# EAGLE design MicroViewUSB (EAGLE 5.11)
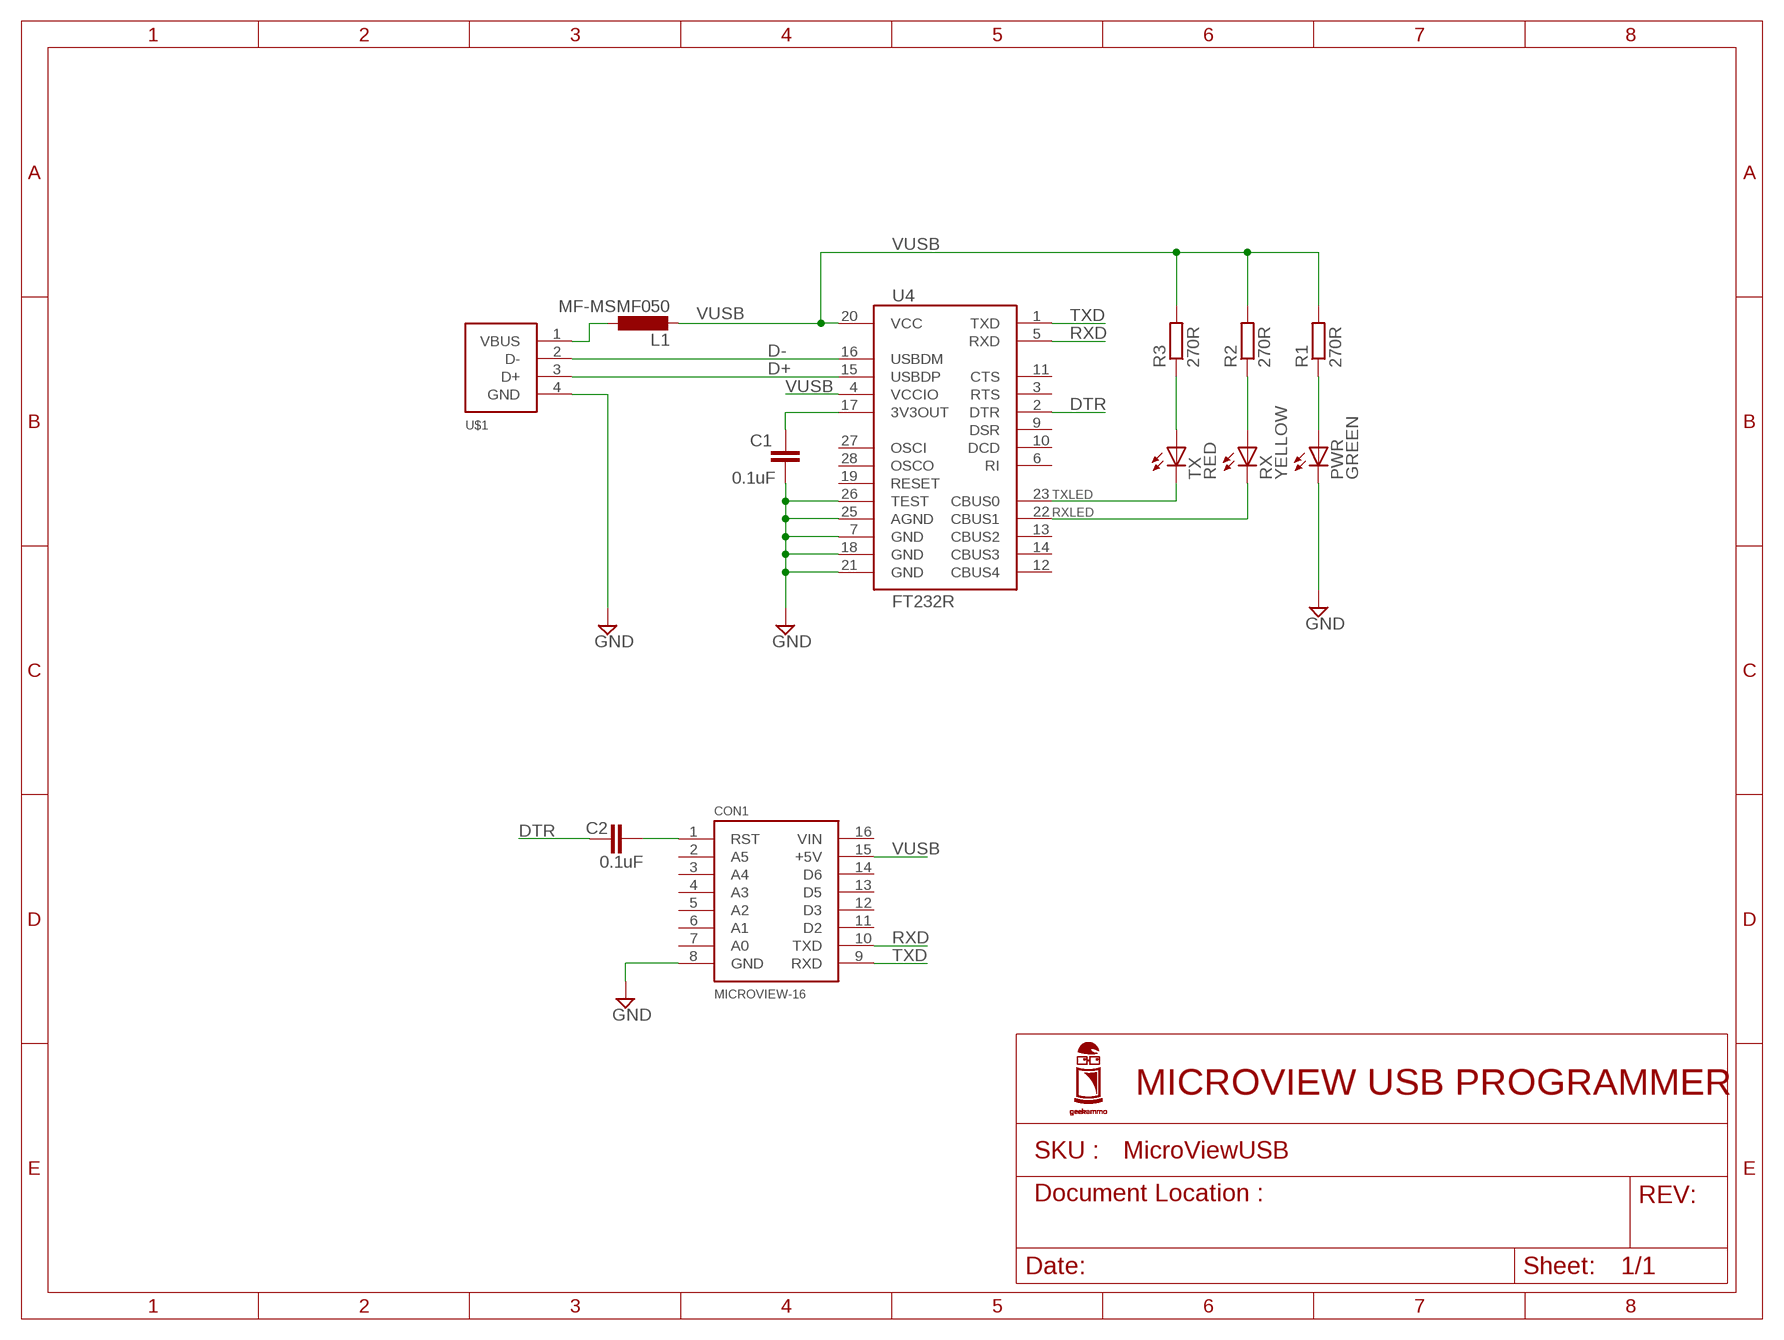
[diagram p0: schematic, sheet 1]

## Parts
C1  0.1uF  C-EUC0603  [C0603]
C2  0.1uF  C-EUC0603  [C0603]
CON1  MICROVIEW-16  [MV-DIP16]
L1  MF-MSMF050  L-EUL1812  [L1812]
PWR  GREEN  LEDCHIP-LED0603  [CHIP-LED0603]
R1  270R  R-EU_R0603  [R0603]
R2  270R  R-EU_R0603  [R0603]
R3  270R  R-EU_R0603  [R0603]
RX  YELLOW  LEDCHIP-LED0603  [CHIP-LED0603]
TX  RED  LEDCHIP-LED0603  [CHIP-LED0603]
U4  FT232R  [SSOP-28]
U$1  USB-CON-4PIN-MALE-A-SMD  [USB-MALE-A-SMD]

## Nets
D+: U4.15(USBDP) U$1.3(D+)
D-: U4.16(USBDM) U$1.2(D-)
DTR: C2.1 U4.2(DTR)
GND: C1.2 CON1.8(GND) PWR.C U4.7(GND) U4.18(GND) U4.21(GND) U4.25(AGND) U4.26(TEST) U$1.4(GND)
N$1: PWR.A R1.1
N$2: L1.1 U$1.1(VBUS)
N$4: C2.2 CON1.1(RST)
N$13: C1.1 U4.17(3V3OUT)
N$17: TX.C U4.23(CBUS0)
N$18: RX.C U4.22(CBUS1)
N$19: R3.1 TX.A
N$20: R2.1 RX.A
RXD: CON1.10(TXD) U4.5(RXD)
TXD: CON1.9(RXD) U4.1(TXD)
VUSB: CON1.15(+5V) L1.2 R1.2 R2.2 R3.2 U4.4(VCCIO) U4.20(VCC)
Unconnected: CON1.2(A5) CON1.3(A4) CON1.4(A3) CON1.5(A2) CON1.6(A1) CON1.7(A0) CON1.11(D2) CON1.12(D3) CON1.13(D5) CON1.14(D6) CON1.16(VIN) U4.3(RTS) U4.6(RI) U4.9(DSR) U4.10(DCD) U4.11(CTS) U4.12(CBUS4) U4.13(CBUS2) U4.14(CBUS3) U4.19(RESET) U4.27(OSCI) U4.28(OSCO)

## Notes on the sheet
- MICROVIEW USB PROGRAMMER

## Library data of the parts
C1 C2 = rcl:C-EU: CAPACITOR, European symbol
CON1 = GeekAmmo:MICROVIEW-16: MicroView
L1 = rcl:L-EU: INDUCTOR, European symbol
PWR RX TX = led:LED: LED OSRAM: - CHIPLED LG R971, LG N971, LY N971, LG Q971, LY Q971, LO R971, LY R971 LH N974, LH R974 LS Q976, LO Q976, LY Q976 LO Q996 - Hyper CHIPLED LW Q18S LB Q993, LB Q99A, LB R99A - SideLED LS A670, LO A670, LY A670, LG A670, LP A670 LB A673, LV A673, LT A673, LW A673 LH A674 LY A675 LS A676, LA A676, LO A676, LY A676, LW A676 LS A679, LY A679, LG A679 - Hyper Micro SIDELED® LS Y876, LA Y876, LO Y876, LY Y876 LT Y87S - SmartLED LW L88C, LW L88S LB L89C, LB L89S, LG L890 LS L89K, LO L89K, LY L89K LS L896, LA L896, LO L896, LY L896 - TOPLED LS T670, LO T670, LY T670, LG T670, LP T670 LSG T670, LSP T670, LSY T670, LOP T670, LYG T670 LG T671, LOG T671, LSG T671 LB T673, LV T673, LT T673, LW T673 LH T674 LS T676, LA T676, LO T676, LY T676, LB T676, LH T676, LSB T676, LW T676 LB T67C, LV T67C, LT T67C, LS T67K, LO T67K, LY T67K, LW E67C LS E67B, LA E67B, LO E67B, LY E67B, LB E67C, LV E67C, LT E67C LW T67C LS T679, LY T679, LG T679 LS T770, LO T770, LY T770, LG T770, LP T770 LB T773, LV T773, LT T773, LW T773 LH T774 LS E675, LA E675, LY E675, LS T675 LS T776, LA T776, LO T776, LY T776, LB T776 LHGB T686 LT T68C, LB T68C - Hyper Mini TOPLED® LB M676 - Mini TOPLED Santana® LG M470 LS M47K, LO M47K, LY M47K Source: http://www.osram.convergy.de LUXEON: - LUMILED® LXK2-PW12-R00, LXK2-PW12-S00, LXK2-PW14-U00, LXK2-PW14-V00 LXK2-PM12-R00, LXK2-PM12-S00, LXK2-PM14-U00 LXK2-PE12-Q00, LXK2-PE12-R00, LXK2-PE12-S00, LXK2-PE14-T00, LXK2-PE14-U00 LXK2-PB12-K00, LXK2-PB12-L00, LXK2-PB12-M00, LXK2-PB14-N00, LXK2-PB14-P00, LXK2-PB14-Q00 LXK2-PR12-L00, LXK2-PR12-M00, LXK2-PR14-Q00, LXK2-PR14-R00 LXK2-PD12-Q00, LXK2-PD12-R00, LXK2-PD12-S00 LXK2-PH12-R00, LXK2-PH12-S00 LXK2-PL12-P00, LXK2-PL12-Q00, LXK2-PL12-R00 Source: www.luxeon.com KINGBRIGHT: KA-3528ASYC Source: www.kingbright.com
R1-R3 = resistor:R-EU_: RESISTOR, European symbol
U4 = GeekAmmo:FT232R: FT232R USB UART IC The FT232R is a USB to serial UART interface with advanced features. http://www.ftdichip.com/Support/Documents/DataSheets/ICs/DS_FT232R.pdf
U$1 = GeekAmmo:USB-CON-4PIN: USB Connector 4 Pin - No SHIELD

## Board
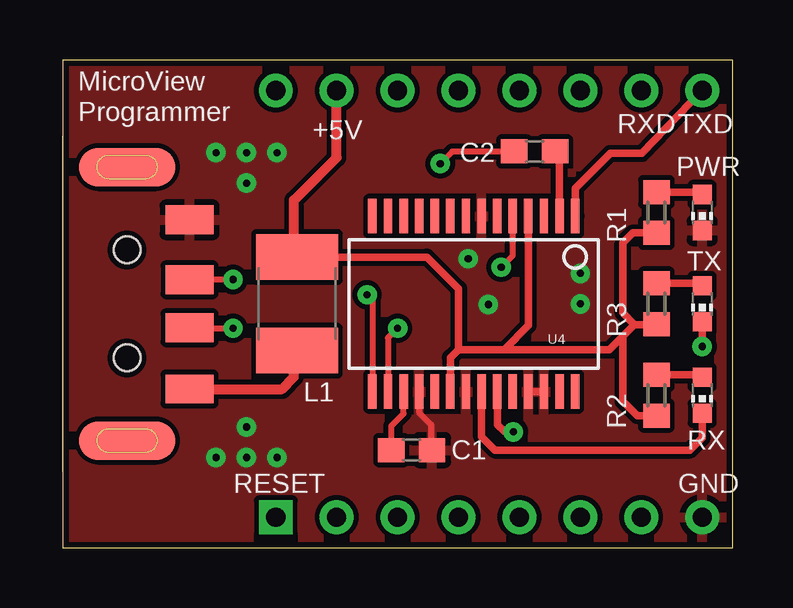
[diagram p1: board, top side]
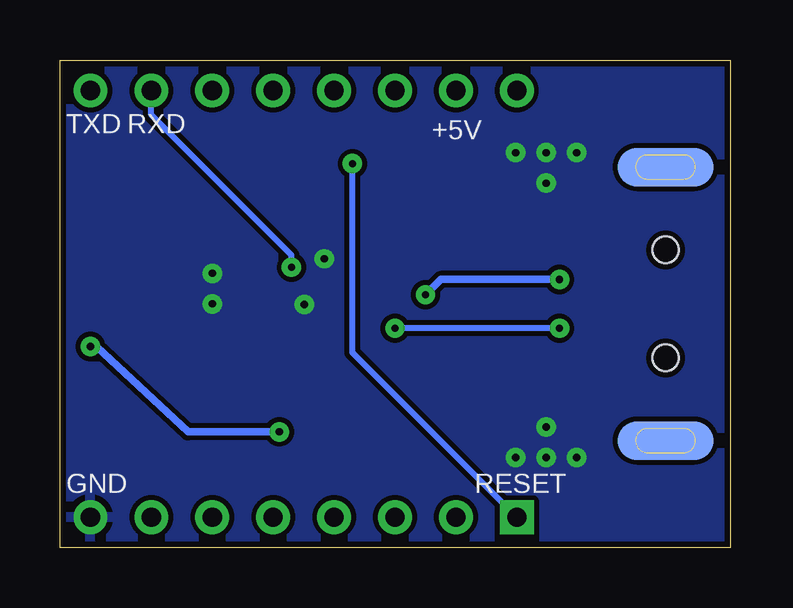
[diagram p2: board, bottom side, seen from below]

Size 27.94 x 20.32 mm. Coordinates in mm from the lower left corner, seen from the top.
Outline: 0,20.32 0,0 27.94,0 27.94,20.32 0,20.32
Copper layers (1*16): Top 0.035mm / dielectric 1.5mm / Bottom 0.035mm
Design rules "SparkFun": minimum track width 8mil, minimum drill 20mil, track to track 8mil, track to pad 8mil, pad to pad 8mil, via to via 8mil, smd to smd 8mil, copper to edge 10mil, drill to drill 8mil, minimum pad ring 12mil, minimum via ring 10mil, stop-mask expansion 4mil, vias tented up to drill 25mil, thermal gap 10mil

### Footprints (pad centres in the part's own frame; a part is rotated, then mirrored left to right if it is on the bottom)
C0603 = smd 1.1 x 1: 1 -0.85,0; 2 0.85,0
MV-DIP16 = drill 0.8 square: 1 0,0 | drill 0.8 round: 2 2.54,0; 3 5.08,0; 4 7.62,0; 5 10.16,0; 6 12.7,0; 7 15.24,0; 8 17.78,0; 9 17.78,17.78; 10 15.24,17.78; 11 12.7,17.78; 12 10.16,17.78; 13 7.62,17.78; 14 5.08,17.78; 15 2.54,17.78; 16 0,17.78
L1812 = smd 1.9 x 3.4: 1 -1.95,0; 2 1.95,0
CHIP-LED0603 = smd 0.8 x 0.8: A 0,-0.75; C 0,0.75
R0603 = smd 1 x 1.1: 1 -0.85,0; 2 0.85,0
SSOP-28 = smd 0.35 x 1.43: 1 -4.225,-3.656; 2 -3.575,-3.656; 3 -2.925,-3.656; 4 -2.275,-3.656; 5 -1.625,-3.656; 6 -0.975,-3.656; 7 -0.325,-3.656; 8 0.325,-3.656; 9 0.975,-3.656; 10 1.625,-3.656; 11 2.275,-3.656; 12 2.925,-3.656; 13 3.575,-3.656; 14 4.225,-3.656; 15 4.225,3.656; 16 3.575,3.656; 17 2.925,3.656; 18 2.275,3.656; 19 1.625,3.656; 20 0.975,3.656; 21 0.325,3.656; 22 -0.325,3.656; 23 -0.975,3.656; 24 -1.625,3.656; 25 -2.275,3.656; 26 -2.925,3.656; 27 -3.575,3.656; 28 -4.225,3.656
USB-MALE-A-SMD = smd 1.2 x 2: 1 3.55,2.6; 2 1,2.6; 3 -1,2.6; 4 -3.5,2.6 | smd 1.6 x 4 bottom: P$1 -5.7,0; P$2 5.7,0 | smd 1.6 x 4: P$5 -5.7,0; P$6 5.7,0 | hole 1.1: -2.25,0; 2.25,0

### Placement (x,y rotation side)
C1  14.55,4.06 0 top
C2  19.68,16.51 180 top
CON1  8.89,1.27 0 top
L1  9.78,10.16 90 top
PWR  26.67,13.97 180 top
R1  24.77,13.97 270 top
R2  24.77,6.35 270 top
R3  24.77,10.16 270 top
RX  26.67,6.35 180 top
TX  26.67,10.16 180 top
U4  17.14,10.16 180 top
U$1  2.69,10.16 270 top

### Tracks (layer width: path | path; a pad name or v marks a point on that pad's centre or on a via)
D+  (via drill 0.3)
  Top 0.254: U4.15 12.92,10.32 v12.7,10.54 | v7.11,11.18 5.31,11.18 U$1.3
  Bottom 0.305: v7.11,11.18 12.06,11.18 v12.7,10.54
D-  (via drill 0.3)
  Top 0.254: U4.16 13.57,8.74 v13.97,9.14 | v7.11,9.14 5.31,9.14 U$1.2
  Bottom 0.254: v7.11,9.14 v13.97,9.14
DTR
  Top 0.305: U4.2 20.72,16.32 C2.1
GND  (via drill 0.3)
  Top 0.254: U4.18 14.87,5.63 15.37,5.13 15.37,4.1 C1.2
  Top 0.305: U4.25 U4.26
  other vias: 21.59,11.43 21.59,10.16 16.92,12.04 17.75,10.13 6.4,16.46 7.67,16.46 8.94,16.46 7.67,15.19 6.4,3.76 7.67,3.76 8.94,3.76 7.67,5.03
  pour Bottom: -2.54,-2.54 30.48,-2.54 30.48,22.86 -2.54,22.86
  pour Top: -1.27,21.59 -1.27,-1.27 29.21,-1.27 29.21,21.59
N$1
  Top 0.305: R1.1 26.57,14.82 PWR.A
N$2
  Top 0.406: U$1.1 9.15,6.61 9.65,7.11 9.65,8.08 L1.1
N$4  (via drill 0.3)
  Top 0.254: C2.2 16.26,16.51 v15.75,16
  Bottom 0.254: v15.75,16 15.75,8.13 CON1.1
N$13
  Top 0.254: U4.17 14.22,5.58 13.72,5.08 13.72,4.08 C1.1
N$17  (via drill 0.3)
  Top 0.305: v26.67,8.38 TX.C | v18.8,4.83 18.44,4.83 18.14,5.13 18.14,6.49 U4.23
  Bottom 0.305: v26.67,8.38 26.42,8.38 22.61,4.83 v18.8,4.83
N$18
  Top 0.305: U4.22 17.47,4.63 18.03,4.06 26.16,4.06 26.67,4.57 RX.C
N$19
  Top 0.305: R3.1 26.57,11.01 TX.A
N$20
  Top 0.305: R2.1 26.57,7.2 RX.A
RXD  (via drill 0.3)
  Top 0.254: U4.5 18.77,12.17 v18.29,11.68
  Bottom 0.254: v18.29,11.68 18.29,12.19 24.13,18.03 CON1.10
TXD
  Top 0.254: U4.1 21.44,13.82
  Top 0.305: CON1.9 24.16,16.43 22.84,16.43 21.39,14.99 21.39,13.83 U4.1
VUSB
  Top 0.305: R2.2 23.96,5.5 23.37,6.1 23.37,8.81 | 23.37,8.81 23.85,9.3 | 23.85,9.3 24.75,9.3 R3.2 | R1.2 23.79,13.12 23.37,12.7 23.37,9.78 23.85,9.3 | U4.20 16.17,7.92 16.51,8.26 | 16.51,8.26 18.41,8.26 | 18.41,8.26 22.81,8.26 23.37,8.81 | L1.2 15.2,12.11 16.51,10.79 16.51,8.26 | U4.4 19.42,9.26 18.41,8.26
  Top 0.406: CON1.15 11.43,16.26 9.65,14.48 9.65,12.24 L1.2

### Text on the board
tPlace: MicroView | Programmer | +5V | RXD | TXD | RESET | GND
bPlace: +5V | RXD | TXD | RESET | GND